# Altium schematic sheet top.SchDoc
size A3; SheetNumber: 1; SheetTotal: 3
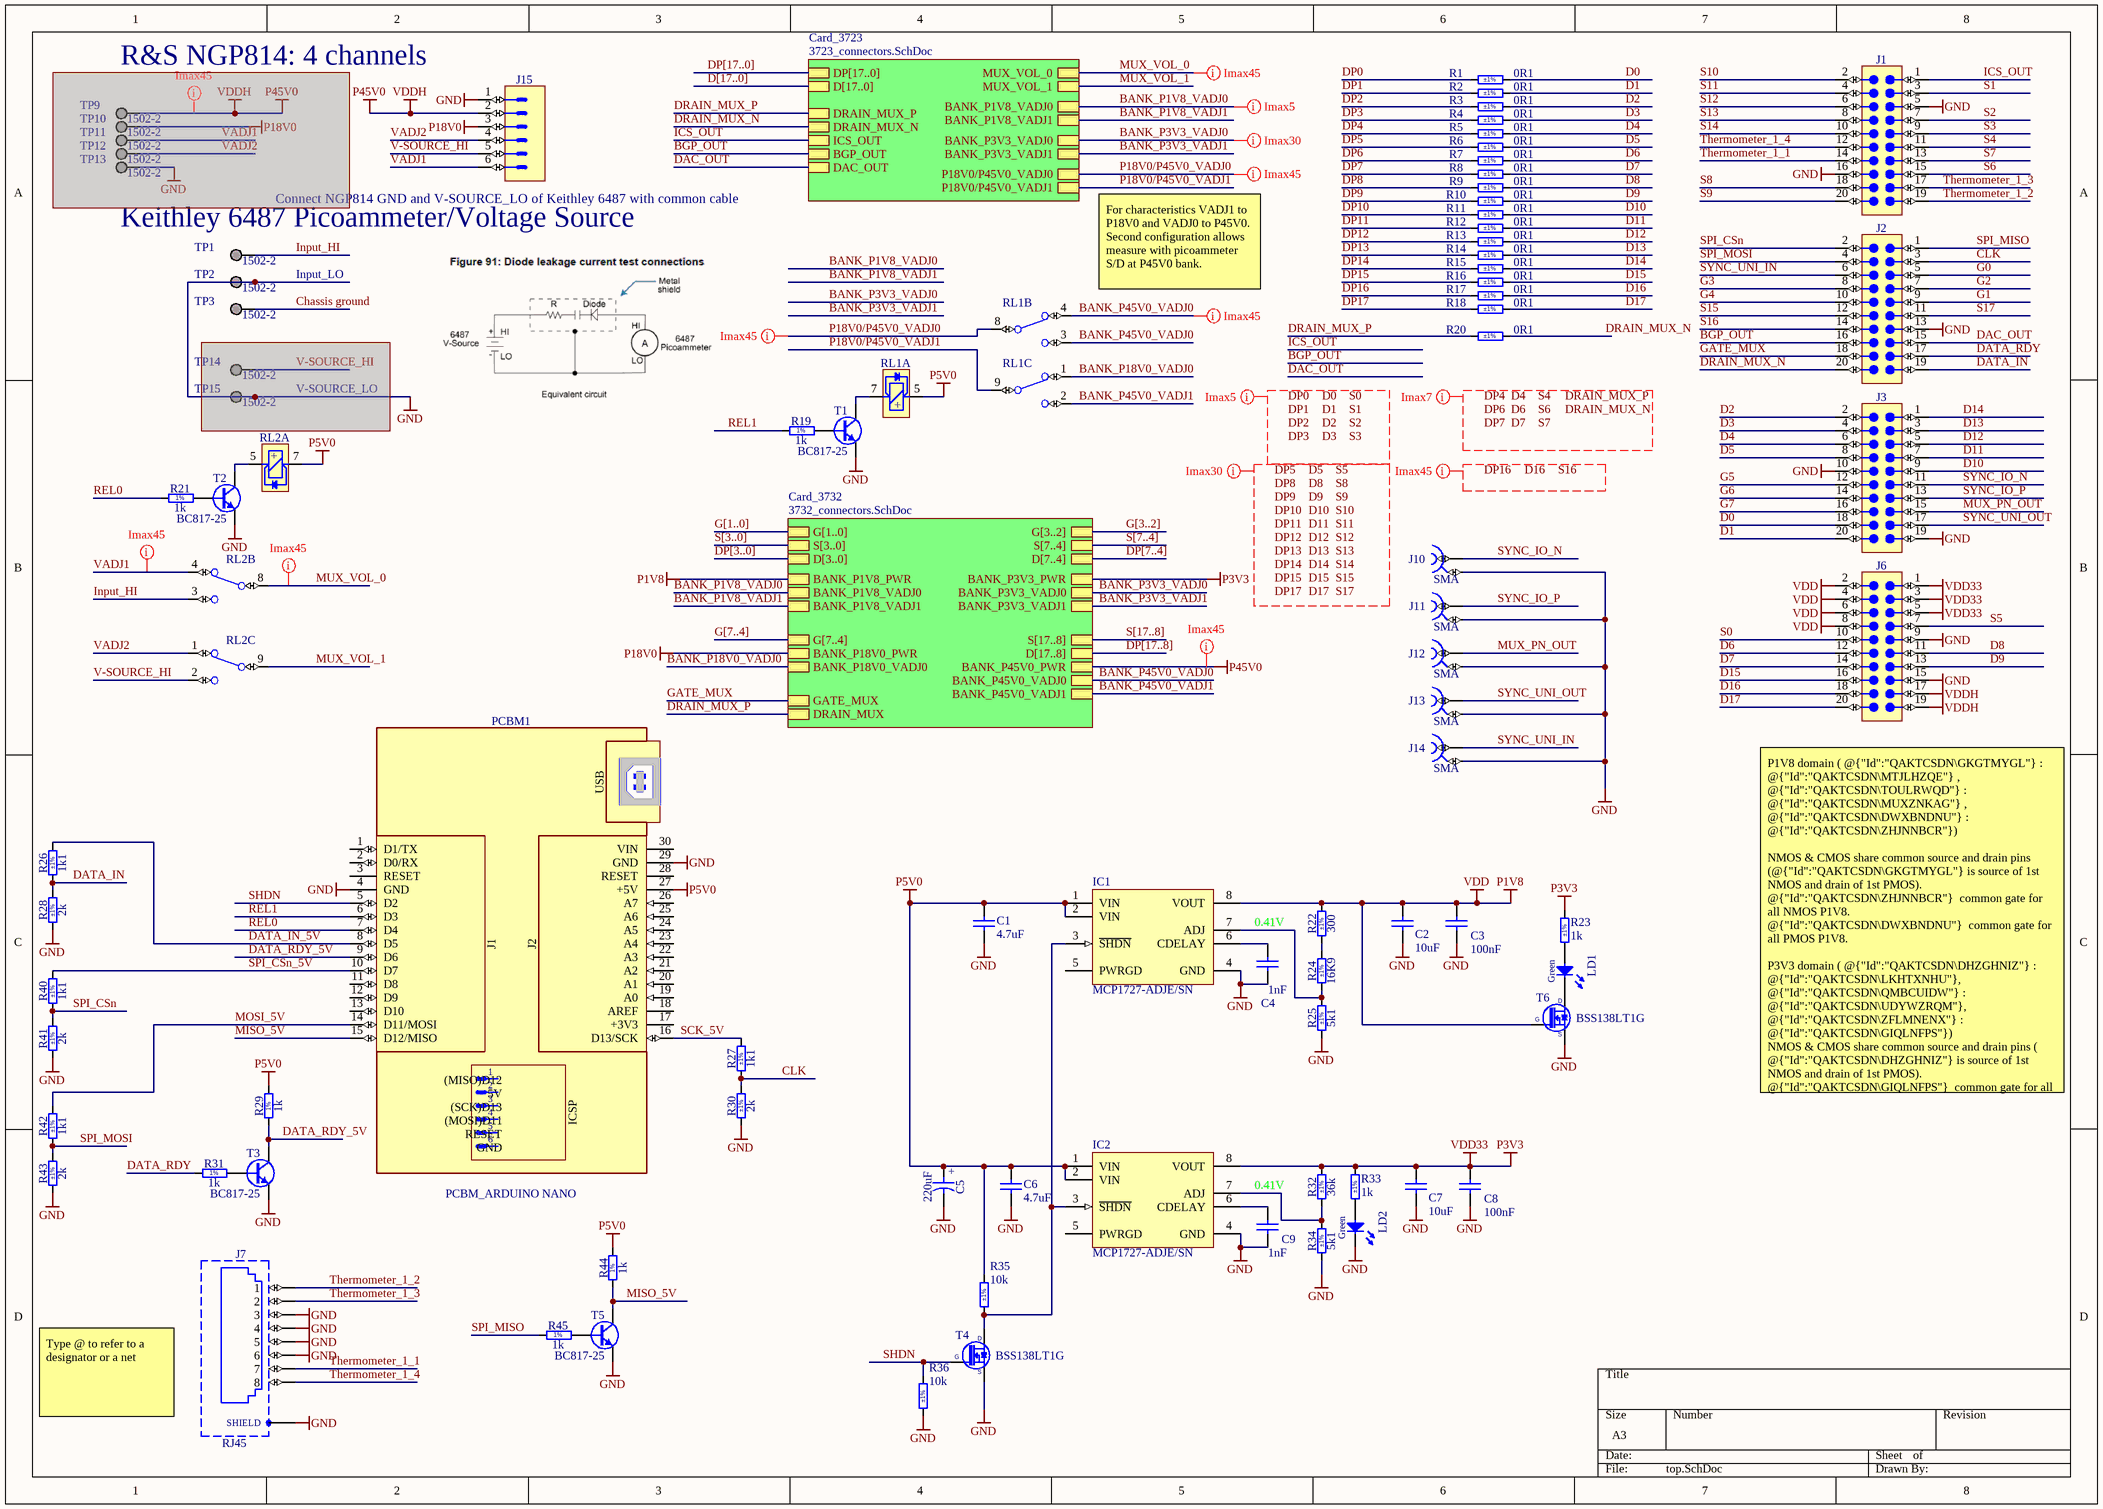
[diagram p0: top.SchDoc]

## Parts
C1  4.7uF  [CAPC1005X55N]
C2  10uF  [CAPC1608X80N]
C3  100nF  [CAPC1005X55N]
C4  1nF  [CAPC1005X55N]
C5  220uF  [CAPMP7343X430N]
C6  4.7uF  [CAPC1005X55N]
C7  10uF  [CAPC1608X80N]
C8  100nF  [CAPC1005X55N]
C9  1nF  [CAPC1005X55N]
IC1  MCP1727-ADJE/SN  [SO-8]
IC2  MCP1727-ADJE/SN  [SO-8]
J1  Header 20  [3M_45220-600230]  (value not drawn)
J2  Header 20  [3M_45220-600230]  (value not drawn)
J3  Header 20  [3M_45220-600230]  (value not drawn)
J6  Header 20  [3M_45220-600230]  (value not drawn)
J7  RJ45  [TYCO_6368150-1]
J10  SMA  [SAMTEC_SMA-J-P-H-ST-TH1]
J11  SMA  [SAMTEC_SMA-J-P-H-ST-TH1]
J12  SMA  [SAMTEC_SMA-J-P-H-ST-TH1]
J13  SMA  [SAMTEC_SMA-J-P-H-ST-TH1]
J14  SMA  [SAMTEC_SMA-J-P-H-ST-TH1]
J15  Mini-Fit Jr.™  [MOLEX_39-30-0060]  (value not drawn)
LD1  Green  [LED_KINGBRIGHT_KP-1608CGCK]
LD2  Green  [LED_KINGBRIGHT_KP-1608CGCK]
PCBM1  PCBM_ARDUINO NANO  [PCBM_ARDUINO NANO_a]
R1  0R1  Tolerance: ±1%  [RESC1608X55N]
R2  0R1  Tolerance: ±1%  [RESC1608X55N]
R3  0R1  Tolerance: ±1%  [RESC1608X55N]
R4  0R1  Tolerance: ±1%  [RESC1608X55N]
R5  0R1  Tolerance: ±1%  [RESC1608X55N]
R6  0R1  Tolerance: ±1%  [RESC1608X55N]
R7  0R1  Tolerance: ±1%  [RESC1608X55N]
R8  0R1  Tolerance: ±1%  [RESC1608X55N]
R9  0R1  Tolerance: ±1%  [RESC1608X55N]
R10  0R1  Tolerance: ±1%  [RESC1608X55N]
R11  0R1  Tolerance: ±1%  [RESC1608X55N]
R12  0R1  Tolerance: ±1%  [RESC1608X55N]
R13  0R1  Tolerance: ±1%  [RESC1608X55N]
R14  0R1  Tolerance: ±1%  [RESC1608X55N]
R15  0R1  Tolerance: ±1%  [RESC1608X55N]
R16  0R1  Tolerance: ±1%  [RESC1608X55N]
R17  0R1  Tolerance: ±1%  [RESC1608X55N]
R18  0R1  Tolerance: ±1%  [RESC1608X55N]
R19  1k  [RESC1005X40N]
R20  0R1  Tolerance: ±1%  [RESC1608X55N]
R21  1k  [RESC1005X40N]
R22  300  Tolerance: ±1%  [RESC1005X40N]
R23  1k  Tolerance: ±1%  [RESC1005X40N]
R24  16K9  Tolerance: ±1%  [RESC1005X40N]
R25  5k1  Tolerance: ±1%  [RESC1005X40N]
R26  1k1  Tolerance: ±1%  [RESC1005X40N]
R27  1k1  Tolerance: ±1%  [RESC1005X40N]
R28  2k  Tolerance: ±1%  [RESC1005X40N]
R29  1k  [RESC1005X40N]
R30  2k  Tolerance: ±1%  [RESC1005X40N]
R31  1k  [RESC1005X40N]
R32  36k  Tolerance: ±1%  [RESC1005X40N]
R33  1k  Tolerance: ±1%  [RESC1005X40N]
R34  5k1  Tolerance: ±1%  [RESC1005X40N]
R35  10k  Tolerance: ±1%  [RESC1005X40N]
R36  10k  Tolerance: ±1%  [RESC1005X40N]
R40  1k1  Tolerance: ±1%  [RESC1005X40N]
R41  2k  Tolerance: ±1%  [RESC1005X40N]
R42  1k1  Tolerance: ±1%  [RESC1005X40N]
R43  2k  Tolerance: ±1%  [RESC1005X40N]
R44  1k  [RESC1005X40N]
R45  1k  [RESC1005X40N]
RL1  REL_PICKERING_107-2-C-5/3D  [REL_PICKERING_107-2-C]  (value not drawn)  (parts A,B,C of 3)
RL2  REL_PICKERING_107-2-C-5/3D  [REL_PICKERING_107-2-C]  (value not drawn)  (parts A,B,C of 3)
T1  BC817-25  [SOT95P230X110-3N]
T2  BC817-25  [SOT95P230X110-3N]
T3  BC817-25  [SOT95P230X110-3N]
T4  BSS138LT1G  [SOT95P240X110-3N]
T5  BC817-25  [SOT95P230X110-3N]
T6  BSS138LT1G  [SOT95P240X110-3N]
TP1  1502-2  [KSTN-1502-2]
TP2  1502-2  [KSTN-1502-2]
TP3  1502-2  [KSTN-1502-2]
TP9  1502-2  [KSTN-1502-2]  (masked out: inside a compile mask, not in the netlist)
TP10  1502-2  [KSTN-1502-2]  (masked out: inside a compile mask, not in the netlist)
TP11  1502-2  [KSTN-1502-2]  (masked out: inside a compile mask, not in the netlist)
TP12  1502-2  [KSTN-1502-2]  (masked out: inside a compile mask, not in the netlist)
TP13  1502-2  [KSTN-1502-2]  (masked out: inside a compile mask, not in the netlist)
TP14  1502-2  [KSTN-1502-2]  (masked out: inside a compile mask, not in the netlist)
TP15  1502-2  [KSTN-1502-2]  (masked out: inside a compile mask, not in the netlist)

## Sub-sheets
Card_3723 = 3723_connectors.SchDoc: D[17..0], DP[17..0], DRAIN_MUX_P, DRAIN_MUX_N, ICS_OUT, BGP_OUT, DAC_OUT, MUX_VOL_0, MUX_VOL_1, BANK_P1V8_VADJ0, BANK_P1V8_VADJ1, BANK_P3V3_VADJ0, BANK_P3V3_VADJ1, P18V0/P45V0_VADJ0, P18V0/P45V0_VADJ1
Card_3732 = 3732_connectors.SchDoc: G[1..0], S[3..0], D[3..0], BANK_P1V8_PWR, BANK_P1V8_VADJ0, BANK_P1V8_VADJ1, G[3..2], S[7..4], D[7..4], BANK_P3V3_PWR, BANK_P3V3_VADJ0, BANK_P3V3_VADJ1, G[7..4], BANK_P18V0_PWR, BANK_P18V0_VADJ0, S[17..8], D[17..8], BANK_P45V0_PWR, BANK_P45V0_VADJ0, GATE_MUX, DRAIN_MUX, BANK_P45V0_VADJ1

## Nets
GND: C1.1 C2.1 C3.1 C4.1 C5.2 C6.1 C7.1 C8.1 C9.1 IC1.4(GND) IC2.4(GND) J1.5 J1.16 J2.13 J3.10 J3.19 J6.9 J6.15 J7.3 J7.4 J7.5 J7.6 J7.SHIELD J10.2 J11.2 J12.2 J13.2 J14.2 J15.1 LD2.1(C) PCBM1.4(GND) PCBM1.29(GND) R25.1 R28.1 R30.1 R34.1 R36.2 R41.1 R43.1 T1.2(E) T2.2(E) T3.2(E) T4.2(S) T5.2(E) T6.2(S) TP2.1
P1V8: C2.2 C3.2 IC1.8(VOUT) J6.2 J6.4 J6.6 J6.8 R22.2 T6.1(G) ; sheet Card_3732/BANK_P1V8_PWR  [also labelled VDD]
P3V3: C7.2 C8.2 IC2.8(VOUT) J6.1 J6.3 J6.5 R23.2 R32.2 R33.2 ; sheet Card_3732/BANK_P3V3_PWR  [also labelled VDD33]
P5V0: C1.2 C5.1 C6.2 IC1.1(VIN) IC1.2(VIN) IC2.1(VIN) IC2.2(VIN) PCBM1.27(+5V) R29.2 R35.1 R44.2 RL1.5(COIL+) RL2.7(COIL-)
P18V0: J15.3 ; sheet Card_3732/BANK_P18V0_PWR
P45V0: J6.17 J6.19 J15.2 ; sheet Card_3732/BANK_P45V0_PWR  [also labelled VDDH]
BANK_P1V8_VADJ0: sheet Card_3732/BANK_P1V8_VADJ0, sheet Card_3723/BANK_P1V8_VADJ0
BANK_P1V8_VADJ1: sheet Card_3732/BANK_P1V8_VADJ1, sheet Card_3723/BANK_P1V8_VADJ1
BANK_P3V3_VADJ0: sheet Card_3732/BANK_P3V3_VADJ0, sheet Card_3723/BANK_P3V3_VADJ0
BANK_P3V3_VADJ1: sheet Card_3732/BANK_P3V3_VADJ1, sheet Card_3723/BANK_P3V3_VADJ1
BANK_P18V0_VADJ0: RL1.1(NC) ; sheet Card_3732/BANK_P18V0_VADJ0
BANK_P45V0_VADJ0: RL1.3(NO) RL1.4(NC) ; sheet Card_3732/BANK_P45V0_VADJ0
BANK_P45V0_VADJ1: RL1.2(NO) ; sheet Card_3732/BANK_P45V0_VADJ1
BGP_OUT: J2.16 ; sheet Card_3723/BGP_OUT
Chassis ground: TP3.1
CLK: J2.3 R27.1 R30.2
D0: J3.18 R1.2
D1: J3.20 R2.2
D2: J3.2 R3.2
D3: J3.4 R4.2
D4: J3.6 R5.2
D5: J3.8 R6.2
D6: J6.12 R7.2
D7: J6.14 R8.2
D8: J6.11 R9.2
D9: J6.13 R10.2
D10: J3.9 R11.2
D11: J3.7 R12.2
D12: J3.5 R13.2
D13: J3.3 R14.2
D14: J3.1 R15.2
D15: J6.16 R16.2
D16: J6.18 R17.2
D17: J6.20 R18.2
DAC_OUT: J2.15 ; sheet Card_3723/DAC_OUT
DATA_IN: J2.19 R26.1 R28.2
DATA_IN_5V: PCBM1.8(D5) R26.2
DATA_RDY: J2.17 R31.1
DATA_RDY_5V: PCBM1.9(D6) R29.1 T3.3(C)
DP0: R1.1
DP1: R2.1
DP2: R3.1
DP3: R4.1
DP4: R5.1
DP5: R6.1
DP6: R7.1
DP7: R8.1
DP8: R9.1
DP9: R10.1
DP10: R11.1
DP11: R12.1
DP12: R13.1
DP13: R14.1
DP14: R15.1
DP15: R16.1
DP16: R17.1
DP17: R18.1
DRAIN_MUX_N: J2.20 R20.2 ; sheet Card_3723/DRAIN_MUX_N
DRAIN_MUX_P: R20.1 ; sheet Card_3732/DRAIN_MUX, sheet Card_3723/DRAIN_MUX_P
G0: J2.5
G1: J2.9
G2: J2.7
G3: J2.8
G4: J2.10
G5: J3.12
G6: J3.14
G7: J3.16
GATE_MUX: J2.18 ; sheet Card_3732/GATE_MUX
ICS_OUT: J1.1 ; sheet Card_3723/ICS_OUT
Input_HI: RL2.3(NO) TP1.1
MISO_5V: PCBM1.15(D12/MISO) R44.1 T5.3(C)
MOSI_5V: PCBM1.14(D11/MOSI) R42.2
MUX_PN_OUT: J3.15 J12.1
MUX_VOL_0: RL2.8(C) ; sheet Card_3723/MUX_VOL_0
MUX_VOL_1: RL2.9(C) ; sheet Card_3723/MUX_VOL_1
P18V0/P45V0_VADJ0: RL1.8(C) ; sheet Card_3723/P18V0/P45V0_VADJ0
P18V0/P45V0_VADJ1: RL1.9(C) ; sheet Card_3723/P18V0/P45V0_VADJ1
REL0: PCBM1.7(D4) R21.1
REL1: PCBM1.6(D3) R19.1
S0: J6.10
S1: J1.3
S2: J1.7
S3: J1.9
S4: J1.11
S5: J6.7
S6: J1.15
S7: J1.13
S8: J1.18
S9: J1.20
S10: J1.2
S11: J1.4
S12: J1.6
S13: J1.8
S14: J1.10
S15: J2.12
S16: J2.14
S17: J2.11
SCK_5V: PCBM1.16(D13/SCK) R27.2
SHDN: PCBM1.5(D2) R36.1 T4.1(G)
SPI_CSn: J2.2 R40.1 R41.2
SPI_CSn_5V: PCBM1.10(D7) R40.2
SPI_MISO: J2.1 R45.1
SPI_MOSI: J2.4 R42.1 R43.2
SYNC_IO_N: J3.11 J10.1
SYNC_IO_P: J3.13 J11.1
SYNC_UNI_IN: J2.6 J14.1
SYNC_UNI_OUT: J3.17 J13.1
Thermometer_1_1: J1.14 J7.7
Thermometer_1_2: J1.19 J7.1
Thermometer_1_3: J1.17 J7.2
Thermometer_1_4: J1.12 J7.8
V-SOURCE_HI: J15.5 RL2.2(NO)
VADJ1: J15.6 RL2.4(NC)
VADJ2: J15.4 RL2.1(NC)
NetC4_2: C4.2 IC1.6(CDELAY)
NetC9_2: C9.2 IC2.6(CDELAY)
NetIC1_3: IC1.3(~{SHDN}) IC2.3(~{SHDN}) R35.2 T4.3(D)
NetIC1_7: IC1.7(ADJ) R24.1 R25.2
NetIC2_7: IC2.7(ADJ) R32.1 R34.2
NetLD1_1: LD1.1(C) T6.3(D)
NetLD1_2: LD1.2(A) R23.1
NetLD2_2: LD2.2(A) R33.1
NetR19_2: R19.2 T1.1(B)
NetR21_2: R21.2 T2.1(B)
NetR22_1: R22.1 R24.2
NetR31_2: R31.2 T3.1(B)
NetR45_2: R45.2 T5.1(B)
NetRL1_7: RL1.7(COIL-) T1.3(C)
NetRL2_5: RL2.5(COIL+) T2.3(C)

Not connected (* = marked no-connect by the designer): IC1 5(PWRGD); IC2 5(PWRGD); PCBM1 1(D1/TX) 2(D0/RX) 3(RESET) 11(D8) 12(D9) 13(D10) 17(+3V3) 18(AREF) 19(A0) 20(A1) 21(A2) 22(A3) 23(A4) 24(A5) 25(A6) 26(A7) 28(RESET) 30(VIN)

## Buses and harness runs
bus D[17..0] = sheet Card_3723/D[17..0]
bus DP[3..0] = sheet Card_3732/D[3..0]
bus DP[7..4] = sheet Card_3732/D[7..4]
bus DP[17..0] = sheet Card_3723/DP[17..0]
bus DP[17..8] = sheet Card_3732/D[17..8]
bus G[1..0] = sheet Card_3732/G[1..0]
bus G[3..2] = sheet Card_3732/G[3..2]
bus G[7..4] = sheet Card_3732/G[7..4]
bus S[3..0] = sheet Card_3732/S[3..0]
bus S[7..4] = sheet Card_3732/S[7..4]
bus S[17..8] = sheet Card_3732/S[17..8]

## Layout directives
net class Imax5: BANK_P1V8_VADJ0, D0, D1, D2, D3, DP0, DP1, DP2, DP3, S0, S1, S2, S3
net class Imax7: D4, D6, D7, DP4, DP6, DP7, DRAIN_MUX_N, DRAIN_MUX_P, S4, S6, S7
net class Imax30: BANK_P3V3_VADJ0, D5, D8, D9, D10, D11, D12, D13, D14, D15, D17, DP5, DP8, DP9, DP10, DP11, DP12, DP13, DP14, DP15, DP17, S5, S8, S9, S10, S11, S12, S13, S14, S15, S17
net class Imax45: (no net found under the mark), BANK_P45V0_VADJ0, D16, DP16, MUX_VOL_0, P18V0/P45V0_VADJ0, P45V0, S16, VADJ1

## Notes on the sheet
- R&S NGP814: 4 channels
- (near TP1) Keithley 6487 Picoammeter/Voltage Source
- (near J15) Connect NGP814 GND and V-SOURCE_LO of Keithley 6487 with common cable
- Input_LO
- For characteristics VADJ1 to P18V0 and VADJ0 to P45V0.
  Second configuration allows measure with picoammeter S/D at P45V0 bank.
- V-SOURCE_LO
- 0.41V
- (near J6) P1V8 domain ( @{"Id":"QAKTCSDN\GKGTMYGL"} : @{"Id":"QAKTCSDN\MTJLHZQE"} , @{"Id":"QAKTCSDN\TOULRWQD"} : @{"Id":"QAKTCSDN\MUXZNKAG"} , @{"Id":"QAKTCSDN\DWXBNDNU"} : @{"Id":"QAKTCSDN\ZHJNNBCR"})
  NMOS & CMOS share common source and drain pins (@{"Id":"QAKTCSDN\GKGTMYGL"} is source of 1st NMOS and drain of 1st PMOS).
  @{"Id":"QAKTCSDN\ZHJNNBCR"}  common gate for all NMOS P1V8.
  @{"Id":"QAKTCSDN\DWXBNDNU"}  common gate for all PMOS P1V8.
  P3V3 domain ( @{"Id":"QAKTCSDN\DHZGHNIZ"} : @{"Id":"QAKTCSDN\LKHTXNHU"}, @{"Id":"QAKTCSDN\QMBCUIDW"} : @{"Id":"QAKTCSDN\UDYWZRQM"}, @{"Id":"QAKTCSDN\ZFLMNENX"} : @{"Id":"QAKTCSDN\GIQLNFPS"})
  NMOS & CMOS share common source and drain pins ( @{"Id":"QAKTCSDN\DHZGHNIZ"} is source of 1st NMOS and drain of 1st PMOS).
  @{"Id":"QAKTCSDN\GIQLNFPS"}  common gate for all NMOS P3V3.
  @{"Id":"QAKTCSDN\ZFLMNENX"}  common gate for all PMOS P1V8.
  P18V0 domain ( @{"Id":"QAKTCSDN\TCQKZZJW"} : @{"Id":"QAKTCSDN\IFVMLPFB"})
  Gates for CMOS in P45V0 domain.
  @{"Id":"QAKTCSDN\TCQKZZJW"}  Gate for first 5 NMOS
  @{"Id":"QAKTCSDN\BTYXEQQY"}  Gate for second 5 NMOS
  @{"Id":"QAKTCSDN\BTVZBPLE"}  Gate for first 5 PMOS
  @{"Id":"QAKTCSDN\IFVMLPFB"}  Gate for second 5 PMOS
  P45V0 domain ( @{"Id":"QAKTCSDN\KKAFSXUZ"} : @{"Id":"QAKTCSDN\VMRQOTMS"}, @{"Id":"QAKTCSDN\EVYYKNRE"} : @{"Id":"QAKTCSDN\AUFCYRPE"})
  Sources and drains for cmos:
  8-12: NMOS, 2 transistors per pin (different gate)
  13-17: PMOS, 2 transistors per pin (different gate)
- Type @ to refer to a designator or a net
- Labels drawn without touching a wire or pin: D0, D1, D2, D3, D4, D5, D6, D7, D8, D9, D10, D11, D12, D13, D14, D15, D16, D17, DP0, DP1, DP2, DP3, DP4, DP5, DP6, DP7, DP8, DP9, DP10, DP11, DP12, DP13, DP14, DP15, DP16, DP17, DRAIN_MUX_N, DRAIN_MUX_P, S0, S1, S2, S3, S4, S5, S6, S7, S8, S9, S10, S11, S12, S13, S14, S15, S16, S17
- (in symbol CTE7343-43_220UF_16V_10%) +
- (in symbol PCBM_ARDUINO NANO_a) USB; J1; J2; (MISO)D12; 5V; (SCK)D13; ICSP; (MOSI)D11
- (in symbol R0402_1K_1%_0.0625W_100PPM) 1%
- (in symbol REL_PICKERING_107-2-C-5/3D, part A) +

## Library data of the parts
C1 C6 = CC0402_4.7UF_10V_10%_X5R: Non-polarised capacitor; Part Description: SMD Multilayer Chip Ceramic Capacitor; Manufacturer: GENERIC; Manufacturer1 Part Number: C1005X5R1A475K050; Voltage: 10V; TC: X5R; Tolerance: ±10%; Value: 4.7uF; Part Number: CC0402_4.7UF_10V_10%_X5R; Component Kind: Standard; Component Type: Standard; Pin Count: 2; Status: Preferred; Manufacturer Part Number: CC0402_4.7UF_10V_10%_X5R; Case: 0402; Mounted: Yes; Socket: No; SMD: Yes; Sense: No; Manufacturer1 Example: TDK; Manufacturer1 ComponentHeight: 0.65mm; HelpURL: \\cern.ch\dfs\Applications\Altium\Datasheets\CC0402_X5R_TDK_C.pdf; Author: CERN DEM BC; CreateDate: 10.01.2020; LatestRevisionDate: 10.01.2020
C2 C7 = CC0603_10UF_10V_10%_X5R: Non-polarised capacitor; Part Description: SMD Multilayer Chip Ceramic Capacitor; Manufacturer: GENERIC; Manufacturer1 Part Number: GRM188R61A106KE69D; Voltage: 10V; TC: X5R; Tolerance: ±10%; Value: 10uF; Part Number: CC0603_10UF_10V_10%_X5R; Component Kind: Standard; Component Type: Standard; Pin Count: 2; Status: None; Manufacturer Part Number: CC0603_10UF_10V_10%_X5R; Case: 0603; Mounted: Yes; Socket: No; SMD: Yes; Sense: No; Manufacturer1 Example: MURATA; Manufacturer1 ComponentHeight: 0.8mm; HelpURL: \\cern.ch\dfs\Applications\Altium\Datasheets\CC0603_MURATA_GRM188R61A106KE69D.pdf; Author: CERN DEM JLC; CreateDate: 31.01.2017; LatestRevisionDate: 31.01.2017
C3 C8 = CC0402_100NF_16V_10%_X5R: Non-polarised capacitor; Part Description: SMD Multilayer Chip Ceramic Capacitor; Manufacturer: GENERIC; Manufacturer1 Part Number: GRM155R61C104KA88D; Voltage: 16V; TC: X5R; Tolerance: ±10%; Value: 100nF; Part Number: CC0402_100NF_16V_10%_X5R; Component Kind: Standard; Component Type: Standard; Pin Count: 2; Status: None; Manufacturer Part Number: CC0402_100NF_16V_10%_X5R; Case: 0402; Mounted: Yes; Socket: No; SMD: Yes; Sense: No; Manufacturer1 Example: MURATA; Manufacturer1 ComponentHeight: 0.55mm; HelpURL: \\cern.ch\dfs\Applications\Altium\Datasheets\CC0402_X5R_MURATA_GRM.pdf; Author: CERN DEM JLC; CreateDate: 10.12.2013; LatestRevisionDate: 10.12.2013
C4 C9 = CC0402_1NF_50V_5%_C0G: Non-polarised capacitor; Part Description: SMD Multilayer Chip Ceramic Capacitor; Manufacturer: GENERIC; Manufacturer1 Part Number: C0402C102J5GACTU; Voltage: 50V; TC: C0G/NP0; Tolerance: ±5%; Value: 1nF; Part Number: CC0402_1NF_50V_5%_C0G; Component Kind: Standard; Component Type: Standard; Pin Count: 2; Status: Preferred; Manufacturer Part Number: CC0402_1NF_50V_5%_C0G; Case: 0402; Mounted: Yes; Socket: No; SMD: Yes; Sense: No; Manufacturer1 Example: KEMET; Manufacturer1 ComponentHeight: 0.55mm; HelpURL: \\cern.ch\dfs\Applications\Altium\Datasheets\CC0402_C0G_KEMET_(Commercial Grade).pdf; Author: CERN DEM BC; CreateDate: 02.09.2019; LatestRevisionDate: 02.09.2019
C5 = CTE7343-43_220UF_16V_10%: Polarised capacitor; Part Description: Solid Tantalum Chip Capacitor; Manufacturer: GENERIC; Manufacturer1 Part Number: TAJE227K016R; Voltage: 16V; Tolerance: ±10%; Part Number: CTE7343-43_220UF_16V_10%; Component Kind: Standard; Component Type: Standard; Pin Count: 2; Value: 220uF; Status: Preferred; Manufacturer Part Number: CTE7343-43_220UF_16V_10%; Case: E; Mounted: Yes; Socket: No; SMD: Yes; Sense: No; Manufacturer1 Example: AVX; Manufacturer1 ComponentHeight: 4.3mm; HelpURL: \\cern.ch\dfs\Applications\Altium\Datasheets\CTE_AVX_TAJ.pdf; Author: CERN DEM JLC; CreateDate: 03.12.2007; LatestRevisionDate: 03.12.2007
IC1 IC2 = MCP1727-ADJE/SN: 1.5A, Low Voltage, Low Quiescent Current LDO Regulator, 8-Pin SOIC 150mil, Extended Temperature; Value: MCP1726-ADJE/SN; Published: 29-Jan-2009; DatasheetVersion: revB, Feb-2007; PackageVersion: revAW, Oct-2008; PackageReference: SOIC-SN8; Publisher: Altium Limited; PackageDescription: 8-Lead Plastic Small Outline (SN) - Narrow, 3.90mm Body [SOIC]; Code_JEDEC: MS-012; Code_IPC: SOIC127P600-8; ComponentLink1Description: Manufacturer Link; ComponentLink1URL: http://www.microchip.com; ComponentLink2Description: Datasheet; ComponentLink2URL: http://ww1.microchip.com/downloads/en/DeviceDoc/21999b.pdf; ComponentLink3Description: Packaging Specification; ComponentLink3URL: http://ww1.microchip.com/downloads/en/PackagingSpec/00049AW.pdf
J1-J3 J6 = 3M_45220-600230: Connector 20 Male; Part Description: 20 Contacts - 1.27mm (0.050") Pitch - Shrouded Boardmount Vertical Header Without Latch/Ejectors, 452 Series; Manufacturer: 3M; PressFit: No; Part Number: 3M_45220-600230; Component Kind: Standard; Component Type: Standard; Pin Count: 20; Family: Header 20; Mounted: Yes; Socket: No; SMD: No; Sense: No; Status: None; Manufacturer Part Number: 45220-600230; ComponentHeight: 5.64mm; HelpURL: \\cern.ch\dfs\Applications\Altium\Datasheets\3M_45220-600230.pdf; Author: CERN DEM MR; CreateDate: 15.08.2019; LatestRevisionDate: 15.08.2019
J7 = TYCO_6368150-1: Connector RJ45 + Shield; Part Description: 1 Port, RJ45 Connector,  8 Positions, Shielded, Straight, Category 5; Manufacturer: TYCO ELECTRONICS; PressFit: No; Part Number: TYCO_6368150-1; Component Kind: Standard; Component Type: Standard; Pin Count: 10; Family: RJ45; Mounted: Yes; Socket: No; SMD: No; Sense: No; Status: None; Manufacturer Part Number: 6368150-1; ComponentHeight: 17.02mm; HelpURL: \\cern.ch\dfs\Applications\Altium\Datasheets\TYCO_6368150-1.pdf; Author: CERN DEM MR; CreateDate: 18.06.2019; LatestRevisionDate: 18.06.2019
J10-J14 = SAMTEC_SMA-J-P-H-ST-TH1: Part Description: 50 Ohm SMA Straight Through-hole PCB Jack; Manufacturer: SAMTEC; PressFit: No; Part Number: SAMTEC_SMA-J-P-H-ST-TH1; Component Kind: Standard; Component Type: Standard; Pin Count: 5; Family: SMA; Mounted: Yes; Socket: No; SMD: No; Sense: No; Status: None; Manufacturer Part Number: SMA-J-P-H-ST-TH1; ComponentHeight: 9.55mm; HelpURL: \\cern.ch\dfs\Applications\Altium\Datasheets\SAMTEC_SMA-J-P-H-ST-TH1.pdf; Author: CERN DEM BC; CreateDate: 11.01.2021; LatestRevisionDate: 11.01.2021
J15 = MOLEX_39-30-0060: Connector 6 Male; Part Description: 4.20mm (.165") Pitch Mini-Fit Jr. Header, Dual Row, Right Angle with Snap-in Plastic Peg PCB Lock, 6 Circuits; Manufacturer: MOLEX; PressFit: No; Part Number: MOLEX_39-30-0060; Component Kind: Standard; Component Type: Standard; Pin Count: 6; Family: Mini-Fit Jr.™; Mounted: Yes; Socket: No; SMD: No; Sense: No; Status: None; Manufacturer Part Number: 39-30-0060; ComponentHeight: 11.4mm; HelpURL: \\cern.ch\dfs\Applications\Altium\Datasheets\MOLEX_39-30-0060.pdf; Author: CERN DEM JMW; CreateDate: 22.06.2017; LatestRevisionDate: 22.06.2017
LD1 LD2 = LED_KINGBRIGHT_KP-1608CGCK: LED Green 1C 2A; Part Description: 1.6x0.8mm SMD Chip Green LED Lamp; PressFit: No; Bonding: No; Part Number: LED_KINGBRIGHT_KP-1608CGCK; Component Kind: Standard; Component Type: Standard; Color: Green; PackageDescription: SMT Green LED, Case 0603, Body L 1.60mm x W 0.80mm x H 1.10mm; Manufacturer: KINGBRIGHT; Manufacturer Part Number: KP-1608CGCK; Pin Count: 2; Case: 0603; Mounted: Yes; Socket: No; SMD: Yes; Sense: No; ComponentHeight: 1.1mm; HelpURL: \\cern.ch\dfs\Applications\Altium\Datasheets\LED_KINGBRIGHT_KP-1608CGCK.pdf; Author: CERN DEM HF; CreateDate: 01.10.2021; LatestRevisionDate: 01.10.2021
PCBM1 = PCBM_ARDUINO NANO_a: Arduino NANO Printed Circuit Board Module; PressFit: No; Sense Comment: Non-washable; Bonding: No; Part Number: PCBM_ARDUINO NANO_a; Component Kind: Standard; Component Type: Standard; Device: PCBM_ARDUINO NANO; PackageDescription: Microcontroller Board Arduino NANO; Part Description: Arduino NANO Printed Circuit Board Module; Manufacturer: ARDUINO; Manufacturer Part Number: ARDUINO NANO; Pin Count: 0; Mounted: Yes; Socket: No; SMD: No; Sense: Yes; ComponentHeight: 12.6mm; Author: CERN DEM HF; HelpURL: \\cern.ch\dfs\Applications\Altium\Datasheets\PCBM_ARDUINO NANO.pdf; CreateDate: 05.10.2022; LatestRevisionDate: 05.10.2022
R1-R18 R20 = R0603_0R1_1%_0.1W_200PPM: Resistor - 1%; Part Description: Low Value Chip Resistor; Manufacturer: GENERIC; Manufacturer1 Part Number: CRL0603-FW-R100ELF; Power: 0.1W; TC: ±200ppm/°C; PressFit: No; Part Number: R0603_0R1_1%_0.1W_200PPM; Component Kind: Standard; Component Type: Standard; Pin Count: 2; Value: 0R1; Status: Preferred; Manufacturer Part Number: R0603_0R1_1%_0.1W_200PPM; Case: 0603; Mounted: Yes; Sense: No; Socket: No; SMD: Yes; Manufacturer1 Example: BOURNS; Manufacturer1 ComponentHeight: 0.55mm; HelpURL: \\cern.ch\dfs\Applications\Altium\Datasheets\R0603_BOURNS_CRL.pdf; Author: CERN DEM JMW; CreateDate: 26.11.2019; LatestRevisionDate: 26.11.2019
R19 R21 R23 R29 R31 R33 R44 R45 = R0402_1K_1%_0.0625W_100PPM: Resistor - 1%; Part Description: General Purpose Thick Film Chip Resistor; Manufacturer: GENERIC; Manufacturer1 Part Number: 232270671002L; TC: ±100ppm/°C; PressFit: No; Part Number: R0402_1K_1%_0.0625W_100PPM; Component Kind: Standard; Component Type: Standard; Pin Count: 2; Value: 1k; Status: Not Recommended; Power: 0.0625W; Manufacturer Part Number: R0402_1K_1%_0.0625W_100PPM; Case: 0402; Mounted: Yes; Sense: No; Socket: No; SMD: Yes; Manufacturer1 Example: YAGEO PHYCOMP; Manufacturer1 ComponentHeight: 0.4mm; HelpURL: \\cern.ch\dfs\Applications\Altium\Datasheets\R0402_Phycomp_RC0402.pdf; Author: CERN DEM JLC; CreateDate: 03.12.2007; LatestRevisionDate: 17.10.2012
  R19 R21 R29 R31 R44 R45: Tolerance: ±1%
R22 = R0402_300R_1%_0.0625W_100PPM: Resistor - 1%; Part Description: General Purpose Thick Film Chip Resistor; Manufacturer: GENERIC; Manufacturer1 Part Number: 232270673001L; TC: ±100ppm/°C; PressFit: No; Part Number: R0402_300R_1%_0.0625W_100PPM; Component Kind: Standard; Component Type: Standard; Pin Count: 2; Value: 300; Status: Not Recommended; Power: 0.0625W; Manufacturer Part Number: R0402_300R_1%_0.0625W_100PPM; Case: 0402; Mounted: Yes; Sense: No; Socket: No; SMD: Yes; Manufacturer1 Example: YAGEO PHYCOMP; Manufacturer1 ComponentHeight: 0.4mm; HelpURL: \\cern.ch\dfs\Applications\Altium\Datasheets\R0402_Phycomp_RC0402.pdf; Author: CERN DEM JLC; CreateDate: 03.12.2007; LatestRevisionDate: 17.10.2012
R24 = R0402_16K9_1%_0.063W_100PPM: Resistor - 1%; Part Description: General Purpose Thick Film Chip Resistor; Manufacturer: GENERIC; Manufacturer1 Part Number: CRCW040216K9FK; Power: 0.063W; TC: ±100ppm/°C; PressFit: No; Part Number: R0402_16K9_1%_0.063W_100PPM; Component Kind: Standard; Component Type: Standard; Pin Count: 2; Value: 16K9; Status: None; Manufacturer Part Number: R0402_16K9_1%_0.063W_100PPM; Case: 0402; Mounted: Yes; Sense: No; Socket: No; SMD: Yes; Manufacturer1 Example: VISHAY; Manufacturer1 ComponentHeight: 0.4mm; HelpURL: \\cern.ch\dfs\Applications\Altium\Datasheets\R0402_VISHAY_CRCW e3.pdf; Author: CERN DEM BC; CreateDate: 10.01.2020; LatestRevisionDate: 10.01.2020
R25 R34 = R0402_5K1_1%_0.0625W_100PPM: Resistor - 1%; Part Description: General Purpose Thick Film Chip Resistor; Manufacturer: GENERIC; Manufacturer1 Part Number: 232270675102L; TC: ±100ppm/°C; PressFit: No; Part Number: R0402_5K1_1%_0.0625W_100PPM; Component Kind: Standard; Component Type: Standard; Pin Count: 2; Value: 5k1; Status: Not Recommended; Power: 0.0625W; Manufacturer Part Number: R0402_5K1_1%_0.0625W_100PPM; Case: 0402; Mounted: Yes; Sense: No; Socket: No; SMD: Yes; Manufacturer1 Example: YAGEO PHYCOMP; Manufacturer1 ComponentHeight: 0.4mm; HelpURL: \\cern.ch\dfs\Applications\Altium\Datasheets\R0402_Phycomp_RC0402.pdf; Author: CERN DEM JLC; CreateDate: 03.12.2007; LatestRevisionDate: 17.10.2012
R26 R27 R40 R42 = R0402_1K1_1%_0.0625W_100PPM: Resistor - 1%; Part Description: General Purpose Thick Film Chip Resistor; Manufacturer: GENERIC; Manufacturer1 Part Number: 232270671102L; TC: ±100ppm/°C; PressFit: No; Part Number: R0402_1K1_1%_0.0625W_100PPM; Component Kind: Standard; Component Type: Standard; Pin Count: 2; Value: 1k1; Status: Not Recommended; Power: 0.0625W; Manufacturer Part Number: R0402_1K1_1%_0.0625W_100PPM; Case: 0402; Mounted: Yes; Sense: No; Socket: No; SMD: Yes; Manufacturer1 Example: YAGEO PHYCOMP; Manufacturer1 ComponentHeight: 0.4mm; HelpURL: \\cern.ch\dfs\Applications\Altium\Datasheets\R0402_Phycomp_RC0402.pdf; Author: CERN DEM JLC; CreateDate: 03.12.2007; LatestRevisionDate: 17.10.2012
R28 R30 R41 R43 = R0402_2K_1%_0.0625W_100PPM: Resistor - 1%; Part Description: General Purpose Thick Film Chip Resistor; Manufacturer: GENERIC; Manufacturer1 Part Number: 232270672002L; TC: ±100ppm/°C; PressFit: No; Part Number: R0402_2K_1%_0.0625W_100PPM; Component Kind: Standard; Component Type: Standard; Pin Count: 2; Value: 2k; Status: Not Recommended; Power: 0.0625W; Manufacturer Part Number: R0402_2K_1%_0.0625W_100PPM; Case: 0402; Mounted: Yes; Sense: No; Socket: No; SMD: Yes; Manufacturer1 Example: YAGEO PHYCOMP; Manufacturer1 ComponentHeight: 0.4mm; HelpURL: \\cern.ch\dfs\Applications\Altium\Datasheets\R0402_Phycomp_RC0402.pdf; Author: CERN DEM JLC; CreateDate: 03.12.2007; LatestRevisionDate: 17.10.2012
R32 = R0402_36K_1%_0.0625W_100PPM: Resistor - 1%; Part Description: General Purpose Thick Film Chip Resistor; Manufacturer: GENERIC; Manufacturer1 Part Number: 232270673603L; TC: ±100ppm/°C; PressFit: No; Part Number: R0402_36K_1%_0.0625W_100PPM; Component Kind: Standard; Component Type: Standard; Pin Count: 2; Value: 36k; Status: Not Recommended; Power: 0.0625W; Manufacturer Part Number: R0402_36K_1%_0.0625W_100PPM; Case: 0402; Mounted: Yes; Sense: No; Socket: No; SMD: Yes; Manufacturer1 Example: YAGEO PHYCOMP; Manufacturer1 ComponentHeight: 0.4mm; HelpURL: \\cern.ch\dfs\Applications\Altium\Datasheets\R0402_Phycomp_RC0402.pdf; Author: CERN DEM JLC; CreateDate: 03.12.2007; LatestRevisionDate: 17.10.2012
R35 R36 = R0402_10K_1%_0.0625W_100PPM: Resistor - 1%; Part Description: General Purpose Thick Film Chip Resistor; Manufacturer: GENERIC; Manufacturer1 Part Number: 232270671003L; TC: ±100ppm/°C; PressFit: No; Value: 10k; Part Number: R0402_10K_1%_0.0625W_100PPM; Component Kind: Standard; Component Type: Standard; Pin Count: 2; Status: Not Recommended; Power: 0.0625W; Manufacturer Part Number: R0402_10K_1%_0.0625W_100PPM; Case: 0402; Mounted: Yes; Sense: No; Socket: No; SMD: Yes; Manufacturer1 Example: YAGEO PHYCOMP; Manufacturer1 ComponentHeight: 0.4mm; HelpURL: \\cern.ch\dfs\Applications\Altium\Datasheets\R0402_Phycomp_RC0402.pdf; Author: CERN DEM JLC; CreateDate: 03.12.2007; LatestRevisionDate: 17.10.2012
RL1 RL2 = REL_PICKERING_107-2-C-5/3D: DPDT (2 Form C) Reed Relay,  For Stacking On 0.2Inches Pitch, 107 Serie; Part Description: 0.25A/200VDC, DPDT (2 Form C) Reed Relay,  For Stacking On 0.2 Inches Pitch, 107 Series; Manufacturer: PICKERING ELECTRONICS; PressFit: No; Value: 5VDC; Part Number: REL_PICKERING_107-2-C-5/3D; Component Kind: Standard; Component Type: Standard; Pin Count: 8; PackageDescription: 8 Leads, Body 24.1 x 4.8mm, 2 Form C Mini-SIL Reed Relay 107 Series; Mounted: Yes; Socket: No; SMD: No; Sense: No; Status: None; Manufacturer Part Number: 107-2-C-5/3D; ComponentHeight: 10.2mm; HelpURL: \\cern.ch\dfs\Applications\Altium\Datasheets\REL_PICKERING_107.pdf; Author: CERN DEM JLC; CreateDate: 31.05.2011; LatestRevisionDate: 31.05.2011
T1-T3 T5 = BC817-25: NPN Transistor; Part Description: 45V 500mA NPN General-Purpose Transistor; Manufacturer: NXP SEMICONDUCTORS; PressFit: No; Bonding: No; Part Number: BC817-25; Component Kind: Standard; Component Type: Standard; Device: BC817-25; PackageDescription: SOT23, 3 pin, Pitch 0.95mm - 1.3mm W X 2.9mm L X 1.1mm H, IPC Medium Density; Manufacturer Part Number: BC817-25; Pin Count: 3; Case: SOT23-3; Mounted: Yes; Socket: No; SMD: Yes; Sense: No; ComponentHeight: 1.1mm; HelpURL: \\cern.ch\dfs\Applications\Altium\Datasheets\BC817-25.pdf; Author: CERN DEM JLC; CreateDate: 28.10.2014; LatestRevisionDate: 28.10.2014
T4 T6 = BSS138LT1G: N-CHANNEL MOSFET WITH DIODE; Part Description: 50V, 200mA N-Channel Enhancement Mode Field-Effect Transistor; Manufacturer: ON SEMICONDUCTOR; PressFit: No; Bonding: No; Part Number: BSS138LT1G; Component Kind: Standard; Component Type: Standard; Device: BSS138LT1G; PackageDescription: SOT23, 0.95mm Pitch; 3 Pin, 1.40mm W X 3.00mm L X 1.10mm H body, IPC Medium Density; Manufacturer Part Number: BSS138LT1G; Pin Count: 3; Case: SOT23-3; Mounted: Yes; Socket: No; SMD: Yes; Sense: No; ComponentHeight: 1.11mm; HelpURL: \\cern.ch\dfs\Applications\Altium\Datasheets\BSS138LT1G.pdf; Author: CERN DEM JLC; CreateDate: 23.03.2009; LatestRevisionDate: 23.03.2009
TP1-TP3 TP9-TP15 = CMP-1672-00001-5: Terminal DBL Turret, Through Hole, RoHS; Manufacturer: Keystone; ComponentLink1URL: http://www.keyelco.com/; ComponentLink2Description: Datasheet; Length: 2.77 mm; Mount: Through Hole; PackageDescription: 1-Pin Through Hole Device, Dia 3.18 mm; Lead Pitch: 0.218 inch; DatasheetVersion: Rev. A, 02/2008; PackageReference: 1502-2; ComponentLink2URL: http://www.keyelco.com/product-pdf.cfm?p=3293; ComponentLink1Description: Manufacturer URL; Mounting Technology: Through Hole; Package Quantity: 1; Pins: 50; REACH SVHC: No SVHC; Contact Finish: Tin; Contact Material: Brass; RoHSCompliant: true